# Altium schematic sheet PROC099B_HD Connector.SchDoc: HD Connector
size 431 x 279 mm; Date: Not shown in title block; ApprovedBy: Not shown in title block; CheckedBy: Not shown in title block; Author: Not shown in title block; CompanyName: Not shown in title block; DrawnBy: Adrian Ozer; Engineer: Not shown in title block; Organization: Not shown in title block; Address1: Not shown in title block; Address2: Not shown in title block; Address3: Not shown in title block; Address4: Not shown in title block; DocumentNumber: 10; Revision: Use project parameter SCH_Rev; SheetNumber: 10; SheetTotal: 16; PageSetup: Record=PageOptions|CenterHorizontal=True|CenterVertical=True|PrintScale=1.00|XCorrection=1.00|YCorrection=1.00|PrintKind=0|BorderSize=5000000|LeftOffset=0|BottomOffset=0|Orientation=2|PaperLength=1000|PaperWidth=1000|Scale=100|PaperSource=15|PrintQuality=600|MediaType=1|DitherType=10|PrintScaleMode=1|PaperKind=Letter; CurrentTime: Not shown in title block; CurrentDate: Not shown in title block; Time: Not shown in title block; DocumentFullPathAndName: Not shown in title block; DocumentName: Not shown in title block; ModifiedDate: Not shown in title block; ImagePath: Not shown in title block
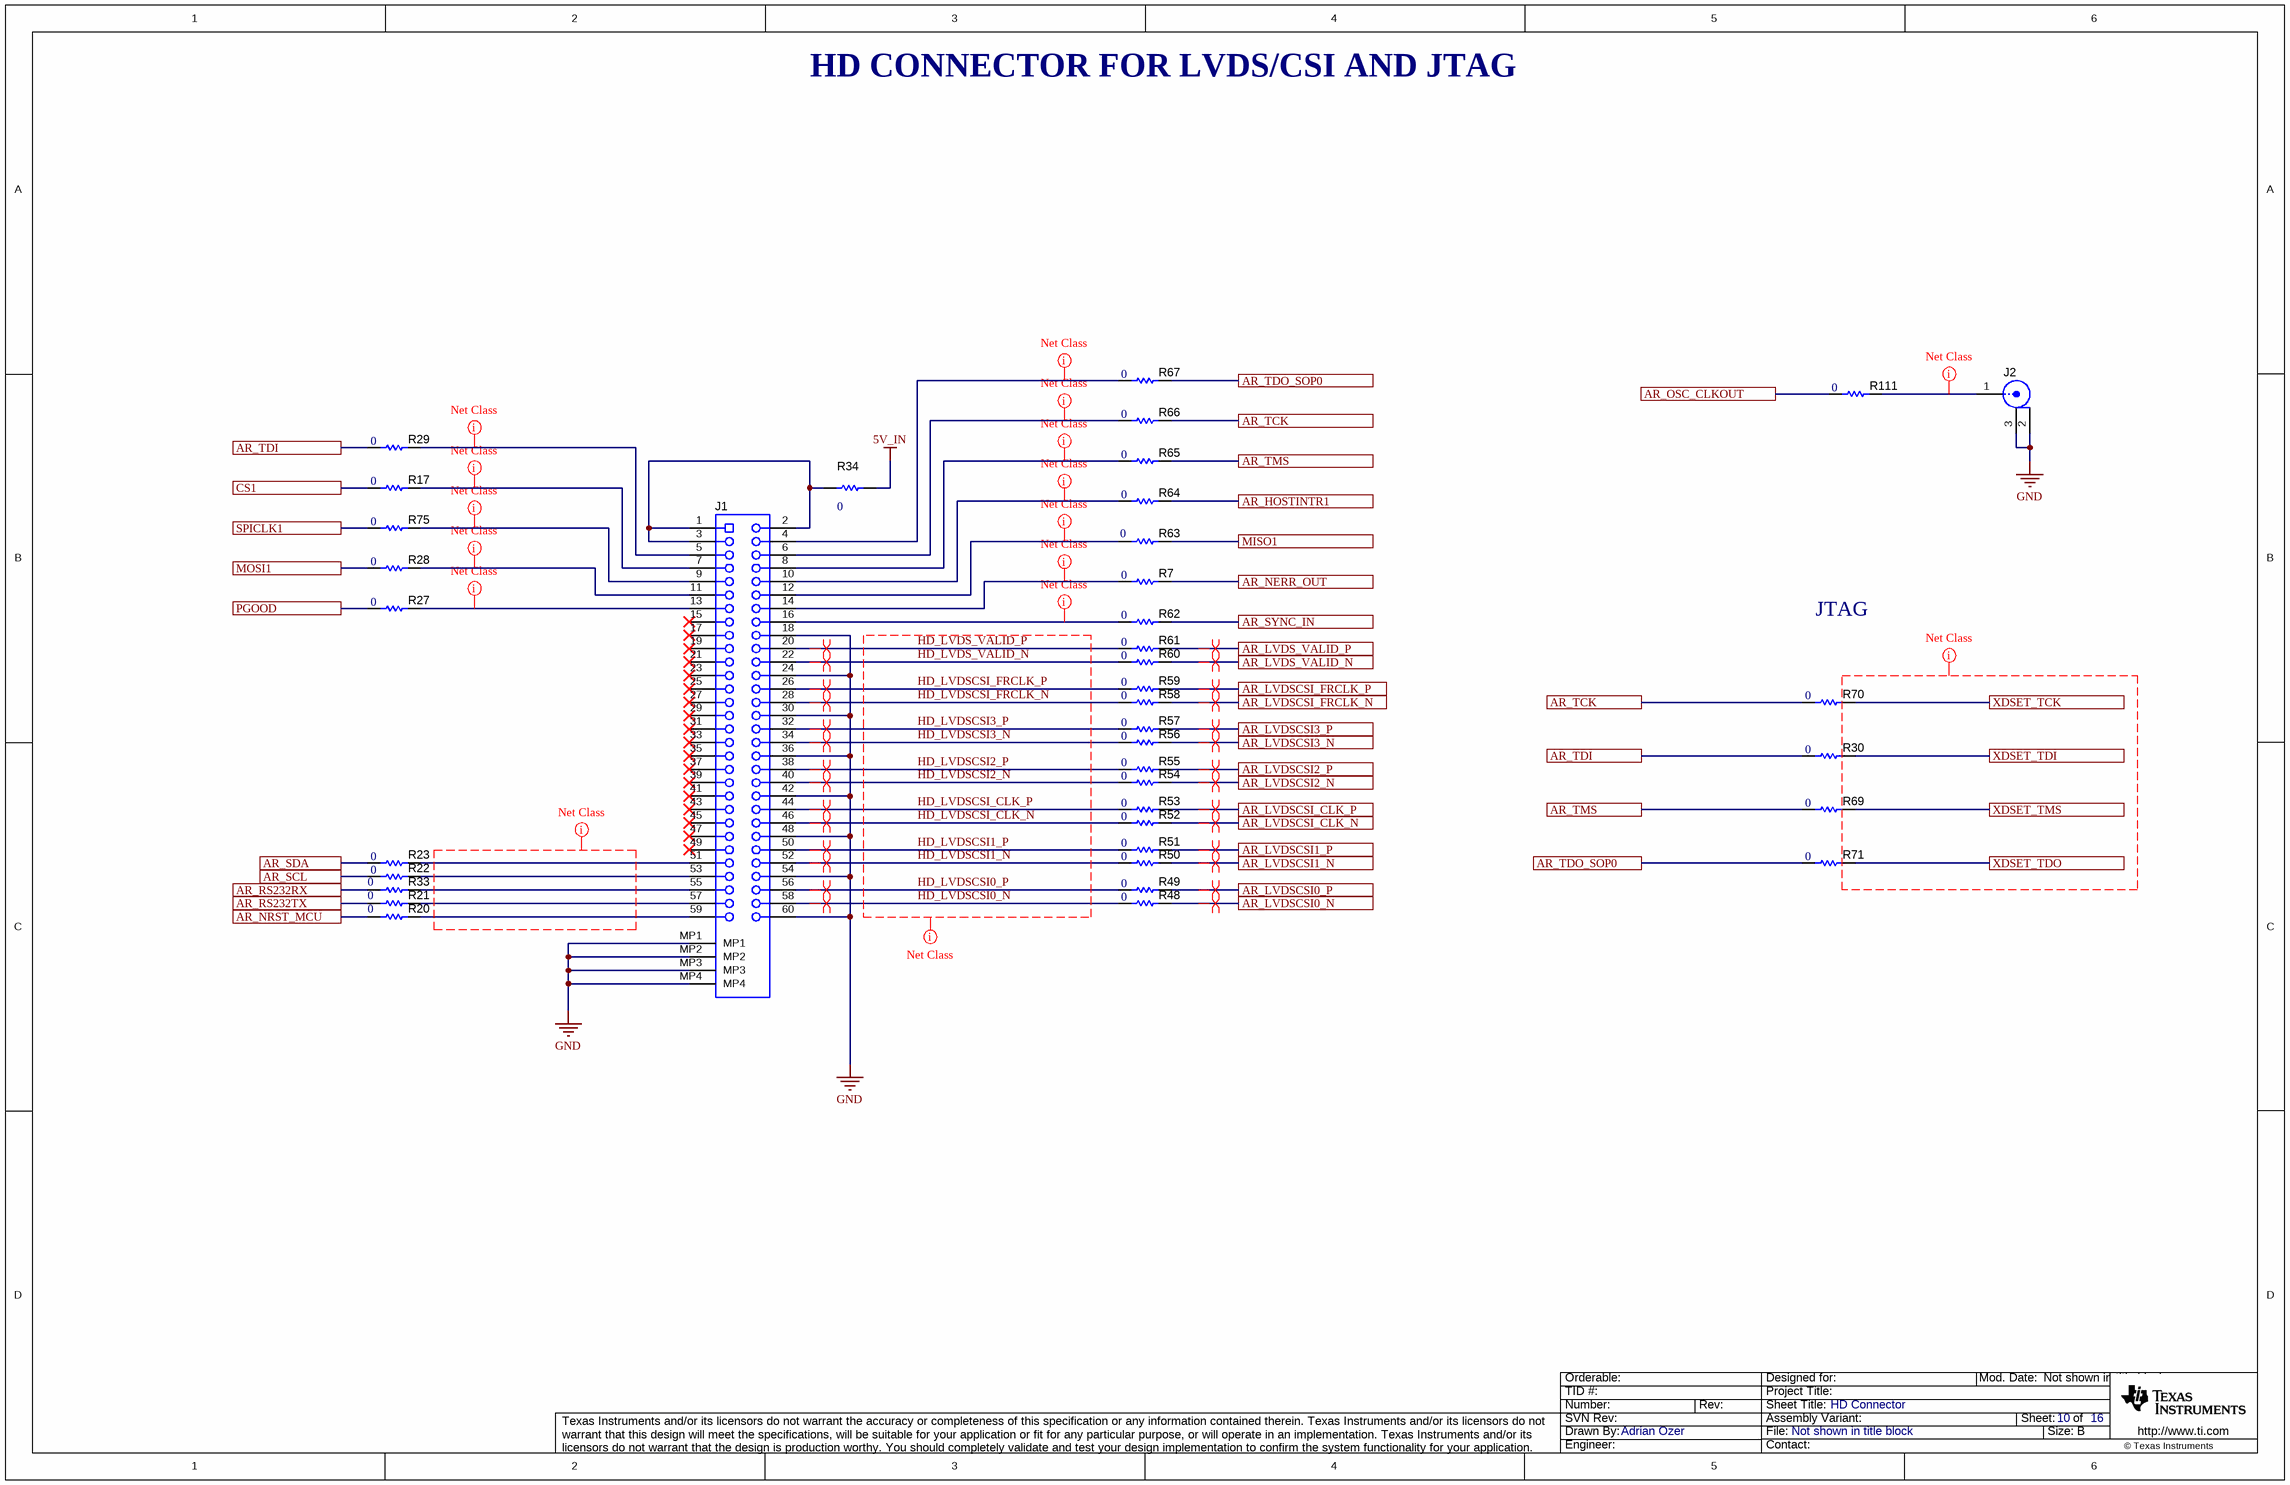
[diagram p0: PROC099B_HD Connector.SchDoc]

## Parts
J1  QSH-030-01-L-D-A  [Samtec_QSH-030-01-X-D-A]  (value not drawn)
J2  128-0711-201  [Johnson_128-0711-201]  (value not drawn)
R7  ValueDisplayed: 0  [0201_Silk]  (hidden comment: CRCW02010000Z0ED)
R17  ValueDisplayed: 0  [0201_Silk]  (hidden comment: CRCW02010000Z0ED)
R20  ValueDisplayed: 0  [0201_Silk]  (hidden comment: CRCW02010000Z0ED)
R21  ValueDisplayed: 0  [0201_Silk]  (hidden comment: CRCW02010000Z0ED)
R22  ValueDisplayed: 0  [0201_Silk]  (hidden comment: CRCW02010000Z0ED)
R23  ValueDisplayed: 0  [0201_Silk]  (hidden comment: CRCW02010000Z0ED)
R27  ValueDisplayed: 0  [0201_Silk]  (hidden comment: CRCW02010000Z0ED)
R28  ValueDisplayed: 0  [0201_Silk]  (hidden comment: CRCW02010000Z0ED)
R29  ValueDisplayed: 0  [0201_Silk]  (hidden comment: CRCW02010000Z0ED)
R30  ValueDisplayed: 0  [0201_Silk]  (hidden comment: CRCW02010000Z0ED)
R33  ValueDisplayed: 0  [0201_Silk]  (hidden comment: CRCW02010000Z0ED)
R34  ValueDisplayed: 0  [2010L]  (hidden comment: CRCW20100000Z0EF)
R48  ValueDisplayed: 0  [0201_Silk]  (hidden comment: CRCW02010000Z0ED)
R49  ValueDisplayed: 0  [0201_Silk]  (hidden comment: CRCW02010000Z0ED)
R50  ValueDisplayed: 0  [0201_Silk]  (hidden comment: CRCW02010000Z0ED)
R51  ValueDisplayed: 0  [0201_Silk]  (hidden comment: CRCW02010000Z0ED)
R52  ValueDisplayed: 0  [0201_Silk]  (hidden comment: CRCW02010000Z0ED)
R53  ValueDisplayed: 0  [0201_Silk]  (hidden comment: CRCW02010000Z0ED)
R54  ValueDisplayed: 0  [0201_Silk]  (hidden comment: CRCW02010000Z0ED)
R55  ValueDisplayed: 0  [0201_Silk]  (hidden comment: CRCW02010000Z0ED)
R56  ValueDisplayed: 0  [0201_Silk]  (hidden comment: CRCW02010000Z0ED)
R57  ValueDisplayed: 0  [0201_Silk]  (hidden comment: CRCW02010000Z0ED)
R58  ValueDisplayed: 0  [0201_Silk]  (hidden comment: CRCW02010000Z0ED)
R59  ValueDisplayed: 0  [0201_Silk]  (hidden comment: CRCW02010000Z0ED)
R60  ValueDisplayed: 0  [0201_Silk]  (hidden comment: CRCW02010000Z0ED)
R61  ValueDisplayed: 0  [0201_Silk]  (hidden comment: CRCW02010000Z0ED)
R62  ValueDisplayed: 0  [0201_Silk]  (hidden comment: CRCW02010000Z0ED)
R63  ValueDisplayed: 0  [0201_Silk]  (hidden comment: CRCW02010000Z0ED)
R64  ValueDisplayed: 0  [0201_Silk]  (hidden comment: CRCW02010000Z0ED)
R65  ValueDisplayed: 0  [0201_Silk]  (hidden comment: CRCW02010000Z0ED)
R66  ValueDisplayed: 0  [0201_Silk]  (hidden comment: CRCW02010000Z0ED)
R67  ValueDisplayed: 0  [0201_Silk]  (hidden comment: CRCW02010000Z0ED)
R69  ValueDisplayed: 0  [0201_Silk]  (hidden comment: CRCW02010000Z0ED)
R70  ValueDisplayed: 0  [0201_Silk]  (hidden comment: CRCW02010000Z0ED)
R71  ValueDisplayed: 0  [0201_Silk]  (hidden comment: CRCW02010000Z0ED)
R75  ValueDisplayed: 0  [0201_Silk]  (hidden comment: CRCW02010000Z0ED)
R111  ValueDisplayed: 0  [0201_Silk]  (hidden comment: CRCW02010000Z0ED)

## Ports
AR_HOSTINTR1, AR_LVDS_VALID_N, AR_LVDS_VALID_P, AR_LVDSCSI0_N, AR_LVDSCSI0_P, AR_LVDSCSI1_N, AR_LVDSCSI1_P, AR_LVDSCSI2_N, AR_LVDSCSI2_P, AR_LVDSCSI3_N, AR_LVDSCSI3_P, AR_LVDSCSI_CLK_N, AR_LVDSCSI_CLK_P, AR_LVDSCSI_FRCLK_N, AR_LVDSCSI_FRCLK_P, AR_NERR_OUT, AR_NRST_MCU, AR_OSC_CLKOUT, AR_RS232RX, AR_RS232TX, AR_SCL, AR_SDA, AR_SYNC_IN, AR_TCK, AR_TDI, AR_TDO_SOP0, AR_TMS, CS1, MISO1, MOSI1, PGOOD, SPICLK1, XDSET_TCK, XDSET_TDI, XDSET_TDO, XDSET_TMS

## Nets
5V_IN: R34.2
GND: J1.18 J1.24 J1.30 J1.36 J1.42 J1.48 J1.54 J1.60 J1.MP1 J1.MP2 J1.MP3 J1.MP4 J2.2 J2.3
AR_HOSTINTR1: R64.2 ; port AR_HOSTINTR1
AR_LVDS_VALID_N: R60.2 ; port AR_LVDS_VALID_N
AR_LVDS_VALID_P: R61.2 ; port AR_LVDS_VALID_P
AR_LVDSCSI0_N: R48.2 ; port AR_LVDSCSI0_N
AR_LVDSCSI0_P: R49.2 ; port AR_LVDSCSI0_P
AR_LVDSCSI1_N: R50.2 ; port AR_LVDSCSI1_N
AR_LVDSCSI1_P: R51.2 ; port AR_LVDSCSI1_P
AR_LVDSCSI2_N: R54.2 ; port AR_LVDSCSI2_N
AR_LVDSCSI2_P: R55.2 ; port AR_LVDSCSI2_P
AR_LVDSCSI3_N: R56.2 ; port AR_LVDSCSI3_N
AR_LVDSCSI3_P: R57.2 ; port AR_LVDSCSI3_P
AR_LVDSCSI_CLK_N: R52.2 ; port AR_LVDSCSI_CLK_N
AR_LVDSCSI_CLK_P: R53.2 ; port AR_LVDSCSI_CLK_P
AR_LVDSCSI_FRCLK_N: R58.2 ; port AR_LVDSCSI_FRCLK_N
AR_LVDSCSI_FRCLK_P: R59.2 ; port AR_LVDSCSI_FRCLK_P
AR_NERR_OUT: R7.2 ; port AR_NERR_OUT
AR_NRST_MCU: R20.1 ; port AR_NRST_MCU
AR_OSC_CLKOUT: R111.1 ; port AR_OSC_CLKOUT
AR_RS232RX: R33.1 ; port AR_RS232RX
AR_RS232TX: R21.1 ; port AR_RS232TX
AR_SCL: R22.1 ; port AR_SCL
AR_SDA: R23.1 ; port AR_SDA
AR_SYNC_IN: R62.2 ; port AR_SYNC_IN
AR_TCK: R66.2 R70.1 ; port AR_TCK
AR_TDI: R29.1 R30.1 ; port AR_TDI
AR_TDO_SOP0: R67.2 R71.1 ; port AR_TDO_SOP0
AR_TMS: R65.2 R69.1 ; port AR_TMS
CS1: R17.1 ; port CS1
HD_LVDS_VALID_N: J1.22 R60.1
HD_LVDS_VALID_P: J1.20 R61.1
HD_LVDSCSI0_N: J1.58 R48.1
HD_LVDSCSI0_P: J1.56 R49.1
HD_LVDSCSI1_N: J1.52 R50.1
HD_LVDSCSI1_P: J1.50 R51.1
HD_LVDSCSI2_N: J1.40 R54.1
HD_LVDSCSI2_P: J1.38 R55.1
HD_LVDSCSI3_N: J1.34 R56.1
HD_LVDSCSI3_P: J1.32 R57.1
HD_LVDSCSI_CLK_N: J1.46 R52.1
HD_LVDSCSI_CLK_P: J1.44 R53.1
HD_LVDSCSI_FRCLK_N: J1.28 R58.1
HD_LVDSCSI_FRCLK_P: J1.26 R59.1
MISO1: R63.2 ; port MISO1
MOSI1: R28.1 ; port MOSI1
PGOOD: R27.1 ; port PGOOD
SPICLK1: R75.1 ; port SPICLK1
XDSET_TCK: R70.2 ; port XDSET_TCK
XDSET_TDI: R30.2 ; port XDSET_TDI
XDSET_TDO: R71.2 ; port XDSET_TDO
XDSET_TMS: R69.2 ; port XDSET_TMS
NetJ1_1: J1.1 J1.2 J1.3 R34.1
NetJ1_4: J1.4 R67.1
NetJ1_5: J1.5 R29.2
NetJ1_6: J1.6 R66.1
NetJ1_7: J1.7 R17.2
NetJ1_8: J1.8 R65.1
NetJ1_9: J1.9 R75.2
NetJ1_10: J1.10 R64.1
NetJ1_11: J1.11 R28.2
NetJ1_12: J1.12 R63.1
NetJ1_13: J1.13 R27.2
NetJ1_14: J1.14 R7.1
NetJ1_16: J1.16 R62.1
NetJ1_51: J1.51 R23.2
NetJ1_53: J1.53 R22.2
NetJ1_55: J1.55 R33.2
NetJ1_57: J1.57 R21.2
NetJ1_59: J1.59 R20.2
NetJ2_1: J2.1 R111.2

Not connected (* = marked no-connect by the designer): J1 15* 17* 19* 21* 23* 25* 27* 29* 31* 33* 35* 37* 39* 41* 43* 45* 47* 49*

## Layout directives
net class GENERAL: (no net found under the mark), NetJ1_13, NetJ1_14, NetJ1_16
net class JTAG: (no net found under the mark), NetJ1_4, NetJ1_5, NetJ1_6, NetJ1_8
net class LVDS: HD_LVDS_VALID_N, HD_LVDS_VALID_P, HD_LVDSCSI0_N, HD_LVDSCSI0_P, HD_LVDSCSI1_N, HD_LVDSCSI1_P, HD_LVDSCSI2_N, HD_LVDSCSI2_P, HD_LVDSCSI3_N, HD_LVDSCSI3_P, HD_LVDSCSI_CLK_N, HD_LVDSCSI_CLK_P, HD_LVDSCSI_FRCLK_N, HD_LVDSCSI_FRCLK_P
net class CLK: NetJ2_1
net class SPI: NetJ1_7, NetJ1_9, NetJ1_10, NetJ1_11, NetJ1_12
differential pair: AR_LVDS_VALID_N, AR_LVDS_VALID_P, AR_LVDSCSI0_N, AR_LVDSCSI0_P, AR_LVDSCSI1_N, AR_LVDSCSI1_P, AR_LVDSCSI2_N, AR_LVDSCSI2_P, AR_LVDSCSI3_N, AR_LVDSCSI3_P, AR_LVDSCSI_CLK_N, AR_LVDSCSI_CLK_P, AR_LVDSCSI_FRCLK_N, AR_LVDSCSI_FRCLK_P, HD_LVDS_VALID_N, HD_LVDS_VALID_P, HD_LVDSCSI0_N, HD_LVDSCSI0_P, HD_LVDSCSI1_N, HD_LVDSCSI1_P, HD_LVDSCSI2_N, HD_LVDSCSI2_P, HD_LVDSCSI3_N, HD_LVDSCSI3_P, HD_LVDSCSI_CLK_N, HD_LVDSCSI_CLK_P, HD_LVDSCSI_FRCLK_N, HD_LVDSCSI_FRCLK_P

## Notes on the sheet
- HD CONNECTOR FOR LVDS/CSI AND JTAG
- JTAG
- Drawn By:
- SVN Rev:
- Number:
- TID #:
- Orderable:
- Rev:
- Sheet Title:
- File:
- Project Title:
- Designed for:
- Assembly Variant:
- Mod. Date:
- Sheet:
- Size:
- of
- B
- http://www.ti.com
- Texas Instruments and/or its licensors do not warrant the accuracy or completeness of this specification or any information contained therein. Texas Instruments and/or its licensors do not warrant that this design will meet the specifications, will be suitable for your application or fit for any particular purpose, or will operate in an implementation. Texas Instruments and/or its licensors do not warrant that the design is production worthy. You should completely validate and test your design implementation to confirm the system functionality for your application.
- Engineer:
- Contact:
- © Texas Instruments

## Library data of the parts
J1 = CMP-0075524-1: Receptacle, 0.5 mm, 30x2, Gold, TH; Manufacturer: Samtec; Pitch_mm: 0.5; Gender: Female; Green_REACh: Passed; CT: False; Shrouded: N; RowSpacing_mm: 5.73; Green_Lifecycle: Active; Row_Count: 2; ComponentLink1Description: Datasheet URL; RoHS: Y; Supplier Part Number 3: 1667876; Supplier 1: Digi-Key; Orientation: Vertical; Green_EU RoHS: Passed with Exemption; PackageReference: Receptacle, 0.5 mm, 30x2, TH; Color: Black; PartNumber: QSH-030-01-L-D-A; PinCount: 60; Publisher: Texas Instruments; Supplier Part Number 2: 19M9181; ContactFinish: Gold; Supplier 2: Newark; ComponentLink1URL: http://www.samtec.com/ftppub/cpdf/QSH-XXX-01-X-D-XX-MKT.pdf; LatestRevisionDate: 2017-07-12; CompType: Receptacle; CNHeader: False; MountType: SMT; Supplier Part Number 1: SAM8180-ND; Supplier 3: Farnell; Green_EU RoHS-2: Passed
J2 = CMP-0055788-1: UMC Straight Jack Receptacle, 50 Ohm, Gold, SMT; Manufacturer: Cinch Connectivity; CNHeader: FALSE; Gender: Female; ComponentLink1URL: https://cinchconnectivity.com/OA_MEDIA/catalog/pdf_UMCCatalogcatalog.pdf; Supplier Part Number 2: 99M0460; Publisher: Texas Instruments; Supplier 2: Newark; Supplier Part Number 3: 530-1280711201; Supplier 3: Mouser; RoHS: Y; MountType: SMT; Supplier 1: Digi-Key; PackageReference: UMC Straight Jack Receptacle, SMT; PinCount: 3; CompType: Jack; LatestRevisionDate: 26/05/2017; PartNumber: 128-0711-201; Orientation: Vertical; ComponentLink1Description: Datasheet URL; Supplier Part Number 1: J983CT-ND; ContactFinish: Gold; CT: FALSE
R7 R17 R20-R23 R27-R30 R33 R48-R67 R69-R71 R75 R111 = CMP-0027008-4: RES, 0, 5%, 0.05 W, 0201; Manufacturer: Vishay-Dale; Power_W: 50mW; TempCo: ppm/C; Value_Code: 0000; Value: 0; EIA_Code: E24; SizeX_mm: 0.6; SizeY_mm: 0.3; SizeZ_mm: 0.26; Value2: 0.05W; SizeArea_mm2: 0.18; AEC Qualified: N; AEC Category: Q200; RoHS: E; Value1: 5%; MountType: SMT; Supplier 1: Newark; PackageReference: 0201; Tolerance_%: 5%; Res_ohm: 0; CompType: Resistor; PartNumber: CRCW02010000Z0ED; ComponentLink1Description: Datasheet link; AEC Grade: N/A; Supplier Part Number 1: 72M6743; Technology: Thick Film; ComponentLink1URL: http://www.vishay.com/docs/20052/crcw0201e3.pdf
R34 = CMP-0016044-3: RES, 0, 5%, 0.75 W, AEC-Q200 Grade 0, 2010; Manufacturer: Vishay-Dale; Power_W: 750mW; TempCo: ppm/C; Value_Code: 0000; Value: 0; EIA_Code: E24; SizeX_mm: 5; SizeY_mm: 2.5; SizeZ_mm: 1.66; Value2: 0.75W; SizeArea_mm2: 12.5; CompType: Resistor; AEC Qualified: Y; AEC Category: Q200; RoHS: E; Value1: 5%; MountType: SMT; Supplier 1: Digi-Key; PackageReference: 2010; Tolerance_%: 5%; Res_ohm: 0; PartNumber: CRCW20100000Z0EF; ComponentLink1Description: Datasheet link; AEC Grade: 0; Supplier Part Number 1: 541-0.0WCT-ND; Technology: Thick Film; ComponentLink1URL: http://www.vishay.com/docs/20035/dcrcwe3.pdf